# Altium project RTL8812AU.PrjPcb
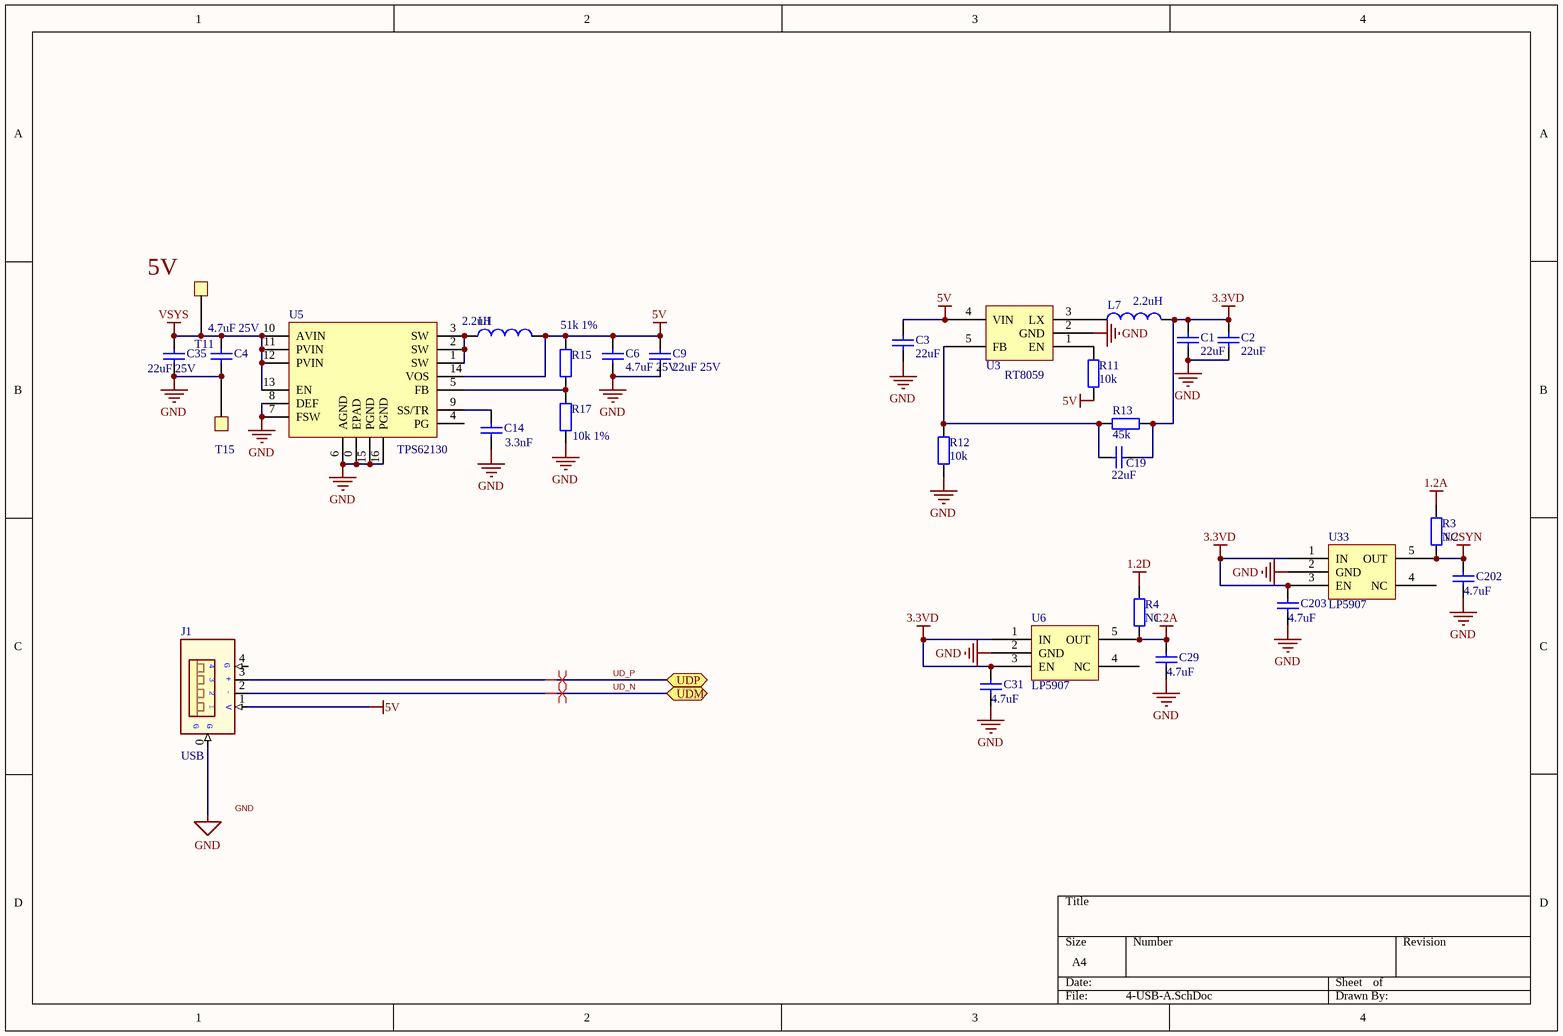
[diagram p0: 4-USB-A.SchDoc]
2 sheets, 106 parts. Net scope: flat (ports and power ports of the same name join across sheets).
Board file: RTL8812AU.PcbDoc
Sheets:
  4-USB-A.SchDoc
  RTL8812AU.SchDoc

## Sheet 4-USB-A.SchDoc
size A4

### Parts
C1  value 22uF  [0805]  (hidden comment: Cap)
C2  value 22uF  [0805]  (hidden comment: Cap)
C3  value 22uF  [0805]  (hidden comment: Cap)
C4  value 4.7uF 25V  [0805]  (hidden comment: Cap)
C6  value 4.7uF 25V  [0805]  (hidden comment: Cap)
C9  value 22uF 25V  [1210]  (hidden comment: Cap)
C14  3.3nF  [0402]
C19  value 22uF  [0402]  (hidden comment: Cap)
C29  4.7uF  [0603]
C31  4.7uF  [0603]
C35  value 22uF 25V  [1210]  (hidden comment: Cap)
C202  4.7uF  [0603]
C203  4.7uF  [0603]
J1  USB  [USB-A-MALE]
L1  2.2uH  [L4015]
L7  2.2uH  [0806]
R3  NC  [0402]
R4  NC  [0402]
R11  10k  [0402]
R12  10k  [0402]
R13  45k  [0402]
R15  51k 1%  [0402]
R17  10k 1%  [0402]
T11  TestPad  [TestPad]  (value not drawn)
T15  TestPad  [TestPad]  (value not drawn)
U3  RT8059  [SOT23-5]
U5  TPS62130  [TPS62130]
U6  LP5907  [SOT23-5]
U33  LP5907  [SOT23-5]

### Ports
UDM (bidir), UDP (bidir)

### Nets
1.2A: C29.2 R3.2 R4.1 U6.5(OUT)
1.2D: R4.2
1.2SYN: C202.2 R3.1 U33.5(OUT)
3.3VD: C1.2 C2.2 C19.1 C31.2 C203.2 L7.2 R13.2 U6.1(IN) U6.3(EN) U33.1(IN) U33.3(EN)
5V: C3.2 C6.2 C9.2 J1.1(V+) L1.2 R11.2 R15.1 U3.4(VIN) U5.14(VOS)
GND: C1.1 C2.1 C3.1 C4.2 C6.1 C9.1 C14.2 C29.1 C31.1 C35.2 C202.1 C203.1 J1.0(G) R12.1 R17.2 T15.1 U3.2(GND) U5.0(EPAD) U5.6(AGND) U5.7(FSW) U5.8(DEF) U5.15(PGND) U5.16(PGND) U6.2(GND) U33.2(GND)
VSYS: C4.1 C35.1 T11.1 U5.10(AVIN) U5.11(PVIN) U5.12(PVIN) U5.13(EN)
UD_N: J1.2(D-) ; port UDM
UD_P: J1.3(D+) ; port UDP
NetC14_1: C14.1 U5.9(SS/TR)
NetC19_2: C19.2 R12.2 R13.1 U3.5(FB)
NetL1_1: L1.1 U5.1(SW) U5.2(SW) U5.3(SW)
NetL7_1: L7.1 U3.3(LX)
NetR11_1: R11.1 U3.1(EN)
NetR15_2: R15.2 R17.1 U5.5(FB)

Not connected (* = marked no-connect by the designer): J1 4(G); U5 4(PG); U6 4(NC); U33 4(NC)

### Layout directives
differential pair: UD_N, UD_P

### Notes on the sheet
- (near T11) 5V
- Labels drawn without touching a wire or pin: GND
- (in symbol USB) +; -; V

### Library data of the parts
C1-C4 C6 C9 C14 C19 C29 C31 C35 C202 C203 = Cap: Capacitor; Published: 8-Jun-2000; LatestRevisionDate: 17-Jul-2002; LatestRevisionNote: Re-released for DXP Platform.; PackageReference: RAD-0.3; Publisher: Altium Limited; PackageDescription: Radial Cap, Thru-Hole; 2 Leads; 0.3 in Pin Spacing
L1 L7 = Inductor: Code_IEC: 1005; Published: 8-Jun-2000; LatestRevisionDate: 29-May-2009; LatestRevisionNote: IPC-7351 Footprint Added.; PackageReference: 0402-A; Publisher: Altium Limited; PackageDescription: Chip Inductor; Code_JEITA: 0402
R3 R4 R11-R13 R15 R17 = Res2: Resistor; Published: 8-Jun-2000; LatestRevisionDate: 17-Jul-2002; LatestRevisionNote: Re-released for DXP Platform.; PackageReference: AXIAL-0.4; Publisher: Altium Limited; PackageDescription: Axial Device, Thru-Hole; 2 Leads; 0.4 in Pin Spacing

## Sheet RTL8812AU.SchDoc
size A3
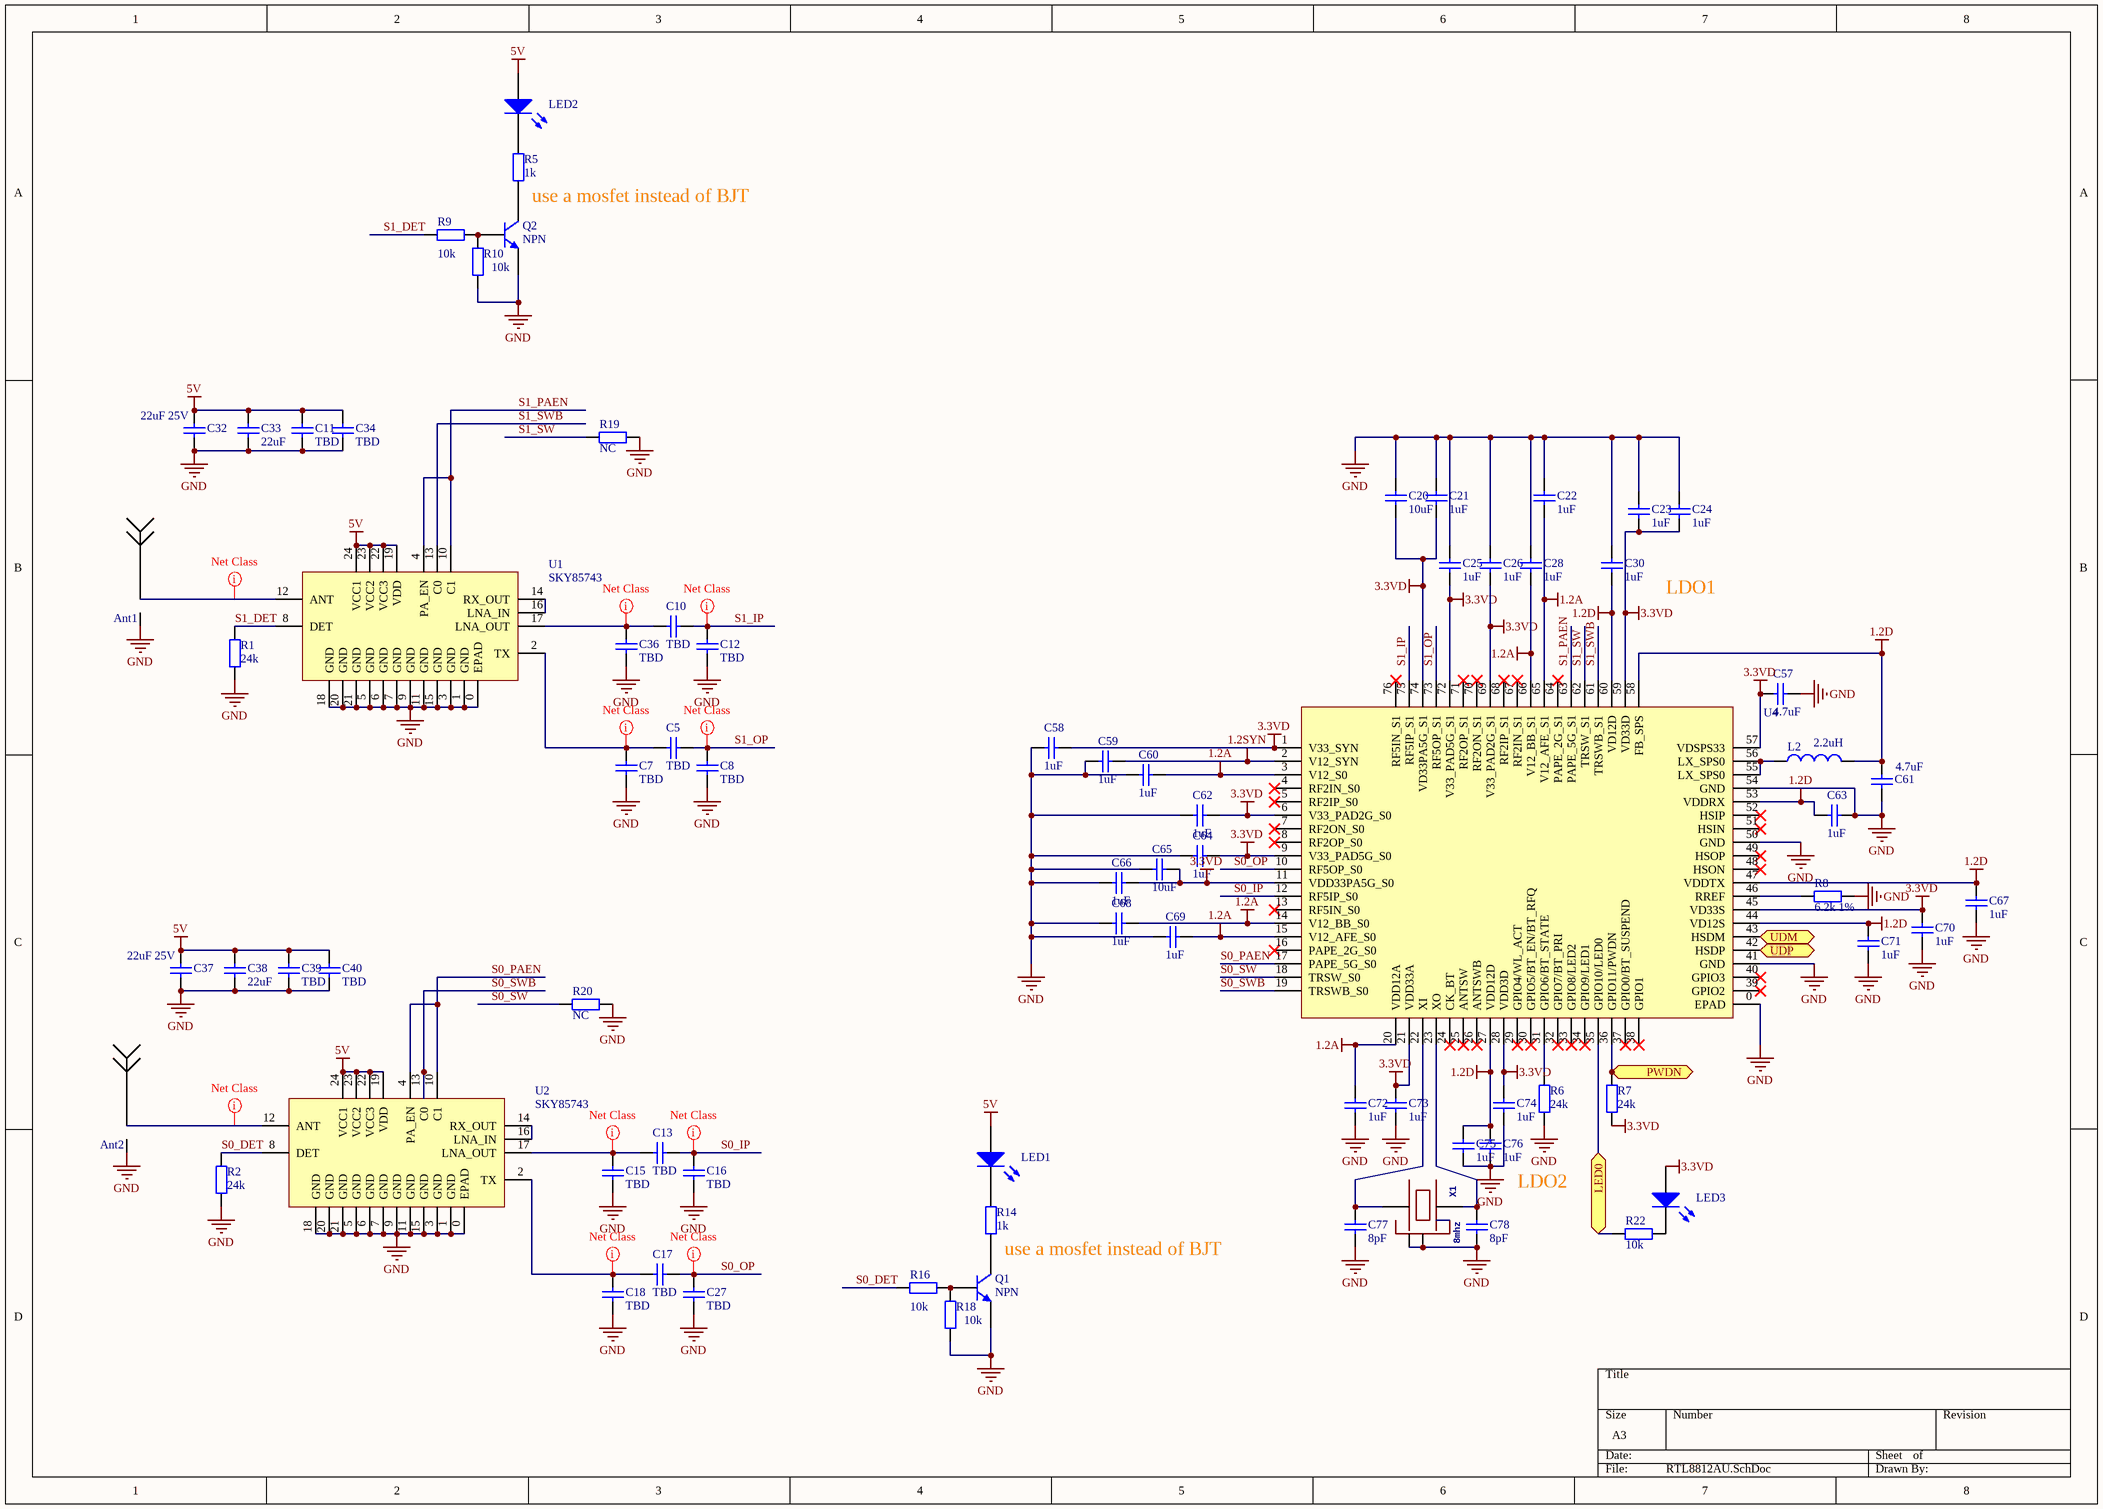
[diagram p1: RTL8812AU.SchDoc]

### Parts
Ant1  Antenna  [SMA-2]  (value not drawn)
Ant2  Antenna  [SMA-2]  (value not drawn)
C5  TBD  [0402]
C7  TBD  [0402]
C8  TBD  [0402]
C10  TBD  [0402]
C11  TBD  [0402]
C12  TBD  [0402]
C13  TBD  [0402]
C15  TBD  [0402]
C16  TBD  [0402]
C17  TBD  [0402]
C18  TBD  [0402]
C20  10uF  [0402]
C21  1uF  [0201]
C22  1uF  [0201]
C23  1uF  [0201]
C24  1uF  [0201]
C25  1uF  [0201]
C26  1uF  [0201]
C27  TBD  [0402]
C28  1uF  [0201]
C30  1uF  [0201]
C32  value 22uF 25V  [1210]  (hidden comment: Cap)
C33  value 22uF  [0805]  (hidden comment: Cap)
C34  TBD  [0402]
C36  TBD  [0402]
C37  value 22uF 25V  [1210]  (hidden comment: Cap)
C38  value 22uF  [0805]  (hidden comment: Cap)
C39  TBD  [0402]
C40  TBD  [0402]
C57  4.7uF  [0603]
C58  1uF  [0201]
C59  1uF  [0201]
C60  1uF  [0201]
C61  4.7uF  [0603]
C62  1uF  [0201]
C63  1uF  [0201]
C64  1uF  [0201]
C65  10uF  [0402]
C66  1uF  [0201]
C67  1uF  [0201]
C68  1uF  [0201]
C69  1uF  [0201]
C70  1uF  [0201]
C71  1uF  [0201]
C72  1uF  [0201]
C73  1uF  [0201]
C74  1uF  [0201]
C75  1uF  [0201]
C76  1uF  [0201]
C77  8pF  [0402]
C78  8pF  [0402]
L2  2.2uH  [0806]
LED1  LED0  [0603]  (value not drawn)
LED2  LED0  [0603]  (value not drawn)
LED3  LED0  [0603]  (value not drawn)
Q1  NPN  [LC-SOT-323(SC-70)]
Q2  NPN  [LC-SOT-323(SC-70)]
R1  24k  [0402]
R2  24k  [0402]
R5  value 1k  [0402]  (hidden comment: Res2)
R6  24k  [0402]
R7  24k  [0402]
R8  6.2k 1%  [0402]
R9  10k  [0402]
R10  10k  [0402]
R14  value 1k  [0402]  (hidden comment: Res2)
R16  10k  [0402]
R18  10k  [0402]
R19  value NC  [0402]  (hidden comment: Res2)
R20  value NC  [0402]  (hidden comment: Res2)
R22  10k  [0402]
U1  SKY85743  [SKY85743]
U2  SKY85743  [SKY85743]
U4  RTL8812AU  [RTL8812AU]  (value not drawn)
X1  8mhz  [OSCILLATOR-3.2X2.5]

### Ports
LED0, PWDN, UDM (bidir), UDP (bidir)

### Nets
1.2A: C22.2 C28.2 C60.2 C68.2 C69.2 C72.1 U4.3(V12_S0) U4.14(V12_BB_S0) U4.15(V12_AFE_S0) U4.20(VDD12A) U4.65(V12_AFE_S1) U4.66(V12_BB_S1)
1.2D: C30.2 C61.2 C63.2 C67.1 C71.1 C75.1 C76.2 L2.2 U4.27(VDD12D) U4.44(VD12S) U4.47(VDDTX) U4.53(VDDRX) U4.58(FB_SPS) U4.60(VD12D)
1.2SYN: C59.2 U4.2(V12_SYN)
3.3VD: C20.1 C21.2 C23.2 C24.2 C25.2 C26.2 C57.2 C58.2 C62.2 C64.2 C65.2 C66.2 C70.1 C73.1 C74.1 LED3.1(A) R7.2 U4.1(V33_SYN) U4.6(V33_PAD2G_S0) U4.9(V33_PAD5G_S0) U4.11(VDD33PA5G_S0) U4.21(VDD33A) U4.28(VDD3D) U4.45(VD33S) U4.57(VDSPS33) U4.59(VD33D) U4.69(V33_PAD2G_S1) U4.72(V33_PAD5G_S1) U4.74(VD33PA5G_S1)
5V: C11.2 C32.2 C33.2 C34.2 C37.2 C38.2 C39.2 C40.2 LED1.1(A) LED2.1(A) U1.19(VDD) U1.22(VCC3) U1.23(VCC2) U1.24(VCC1) U2.19(VDD) U2.22(VCC3) U2.23(VCC2) U2.24(VCC1)
GND: Ant1.GND(G) Ant2.GND(G) C7.1 C8.1 C11.1 C12.1 C15.1 C16.1 C18.1 C20.2 C21.1 C22.1 C23.1 C24.1 C25.1 C26.1 C27.1 C28.1 C30.1 C32.1 C33.1 C34.1 C36.1 C37.1 C38.1 C39.1 C40.1 C57.1 C58.1 C59.1 C60.1 C61.1 C62.1 C63.1 C64.1 C65.1 C66.1 C67.2 C68.1 C69.1 C70.2 C71.2 C72.2 C73.2 C74.2 C75.2 C76.1 C77.1 C78.2 Q1.2(E) Q2.2(E) R1.2 R2.2 R6.2 R8.1 R10.1 R18.1 R19.2 R20.2 U1.0(EPAD) U1.1(GND) U1.3(GND) U1.5(GND) U1.6(GND) U1.7(GND) U1.9(GND) U1.11(GND) U1.15(GND) U1.18(GND) U1.20(GND) U1.21(GND) U2.0(EPAD) U2.1(GND) U2.3(GND) U2.5(GND) U2.6(GND) U2.7(GND) U2.9(GND) U2.11(GND) U2.15(GND) U2.18(GND) U2.20(GND) U2.21(GND) U4.0(EPAD) U4.41(GND) U4.50(GND) U4.54(GND) X1.2(NC_2) X1.4(NC_4)
S0_DET: R2.1 R16.1 U2.8(DET)
S0_IP: C13.1 C16.2 U4.12(RF5IP_S0)
S0_OP: C17.1 C27.2 U4.10(RF5OP_S0)
S0_PAEN: U2.4(PA_EN) U2.10(C1) U4.17(PAPE_5G_S0)
S0_SW: R20.1 U4.18(TRSW_S0)
S0_SWB: U2.13(C0) U4.19(TRSWB_S0)
S1_DET: R1.1 R9.1 U1.8(DET)
S1_IP: C10.1 C12.2 U4.75(RF5IP_S1)
S1_OP: C5.1 C8.2 U4.73(RF5OP_S1)
S1_PAEN: U1.4(PA_EN) U1.10(C1) U4.63(PAPE_5G_S1)
S1_SW: R19.1 U4.62(TRSW_S1)
S1_SWB: U1.13(C0) U4.61(TRSWB_S1)
UD_N: U4.43(HSDM) ; port UDM
UD_P: U4.42(HSDP) ; port UDP
NetAnt1_1: Ant1.1 U1.12(ANT)
NetAnt2_1: Ant2.1 U2.12(ANT)
NetC5_2: C5.2 C7.2 U1.2(TX)
NetC10_2: C10.2 C36.2 U1.17(LNA_OUT)
NetC13_2: C13.2 C15.2 U2.17(LNA_OUT)
NetC17_2: C17.2 C18.2 U2.2(TX)
NetC77_2: C77.2 U4.22(XI) X1.1
NetC78_1: C78.1 U4.23(XO) X1.3
NetL2_1: L2.1 U4.55(LX_SPS0) U4.56(LX_SPS0)
NetLED1_2: LED1.2(K) R14.1
NetLED2_2: LED2.2(K) R5.1
NetLED3_2: LED3.2(K) R22.2
NetQ1_1: Q1.1(B) R16.2 R18.2
NetQ1_3: Q1.3(C) R14.2
NetQ2_1: Q2.1(B) R9.2 R10.2
NetQ2_3: Q2.3(C) R5.2
NetR6_1: R6.1 U4.31(GPIO6/BT_STATE)
NetR7_1: R7.1 U4.36(GPIO11/PWDN) ; port PWDN
NetR8_2: R8.2 U4.46(RREF)
NetR22_1: R22.1 U4.35(GPIO10/LED0) ; port LED0
NetU1_14: U1.14(RX_OUT) U1.16(LNA_IN)
NetU2_14: U2.14(RX_OUT) U2.16(LNA_IN)

Not connected (* = marked no-connect by the designer): U4 4(RF2IN_S0)* 5(RF2IP_S0)* 7(RF2ON_S0)* 8(RF2OP_S0)* 13(RF5IN_S0)* 16(PAPE_2G_S0)* 24(CK_BT)* 25(ANTSW)* 26(ANTSWB)* 29(GPIO4/WL_ACT)* 30(GPIO5/BT_EN/BT_RFQ)* 32(GPIO7/BT_PRI)* 33(GPIO8/LED2)* 34(GPIO9/LED1)* 37(GPIO0/BT_SUSPEND)* 38(GPIO1)* 39(GPIO2)* 40(GPIO3)* 48(HSON)* 49(HSOP)* 51(HSIN)* 52(HSIP)* 64(PAPE_2G_S1)* 67(RF2IN_S1)* 68(RF2IP_S1)* 70(RF2ON_S1)* 71(RF2OP_S1)* 76(RF5IN_S1)*

### Layout directives
net class 50R: NetAnt1_1, NetAnt2_1, NetC5_2, NetC10_2, NetC13_2, NetC17_2, S0_IP, S0_OP, S1_IP, S1_OP

### Notes on the sheet
- use a mosfet instead of BJT
- LDO1
- LDO2

### Library data of the parts
C5 C7 C8 C10-C13 C15-C18 C20-C28 C30 C32-C34 C36-C40 C57-C78 = Cap: Capacitor; Published: 8-Jun-2000; LatestRevisionDate: 17-Jul-2002; LatestRevisionNote: Re-released for DXP Platform.; PackageReference: RAD-0.3; Publisher: Altium Limited; PackageDescription: Radial Cap, Thru-Hole; 2 Leads; 0.3 in Pin Spacing
L2 = Inductor: Code_IEC: 1005; Published: 8-Jun-2000; LatestRevisionDate: 29-May-2009; LatestRevisionNote: IPC-7351 Footprint Added.; PackageReference: 0402-A; Publisher: Altium Limited; PackageDescription: Chip Inductor; Code_JEITA: 0402
LED1-LED3 = LED0: Typical INFRARED GaAs LED; Published: 8-Jun-2000; LatestRevisionDate: 08-Jul-2005; LatestRevisionNote: Mech Layer 1 removed.; PackageReference: LED-0; Publisher: Altium Limited; PackageDescription: LED; 2 Leads
Q1 Q2 = NPN: NPN Bipolar Transistor; Published: 8-Jun-2000; LatestRevisionDate: 17-Jul-2002; LatestRevisionNote: Re-released for DXP Platform.; PackageReference: TO-226-AA; Publisher: Altium Limited; PackageDescription: TO, Flat Index; 3 In-Line, Axial Leads; Body Dia. 4.8mm; Leads 0.55 x 0.51 mm (max); Code_JEDEC: TO-226-AA
R1 R2 R5-R10 R14 R16 R18-R20 = Res2: Resistor; Published: 8-Jun-2000; LatestRevisionDate: 17-Jul-2002; LatestRevisionNote: Re-released for DXP Platform.; PackageReference: AXIAL-0.4; Publisher: Altium Limited; PackageDescription: Axial Device, Thru-Hole; 2 Leads; 0.4 in Pin Spacing
R22 = Res2: Resistor; Value: 0Ohm; Published: 8-Jun-2000; LatestRevisionDate: 17-Jul-2002; LatestRevisionNote: Re-released for DXP Platform.; PackageReference: AXIAL-0.4; Publisher: Altium Limited; PackageDescription: Axial Device, Thru-Hole; 2 Leads; 0.4 in Pin Spacing
X1 = OSCILLATOR-3.2X2.5: Crystal Oscillator in 3.2x2.5 SMD

## Nets that join several sheets
1.2A: 4-USB-A (C29.2 R3.2 R4.1 U6.5), RTL8812AU (12 pins)
1.2D: 4-USB-A (R4.2), RTL8812AU (14 pins)
1.2SYN: 4-USB-A (C202.2 R3.1 U33.5), RTL8812AU (C59.2 U4.2)
3.3VD: 4-USB-A (11 pins), RTL8812AU (29 pins)
5V: 4-USB-A (9 pins), RTL8812AU (18 pins)
GND: 4-USB-A (25 pins), RTL8812AU (89 pins)
UD_N: 4-USB-A (J1.2), RTL8812AU (U4.43)
UD_P: 4-USB-A (J1.3), RTL8812AU (U4.42)